# EAGLE board lil_rgb (EAGLE 5.10)
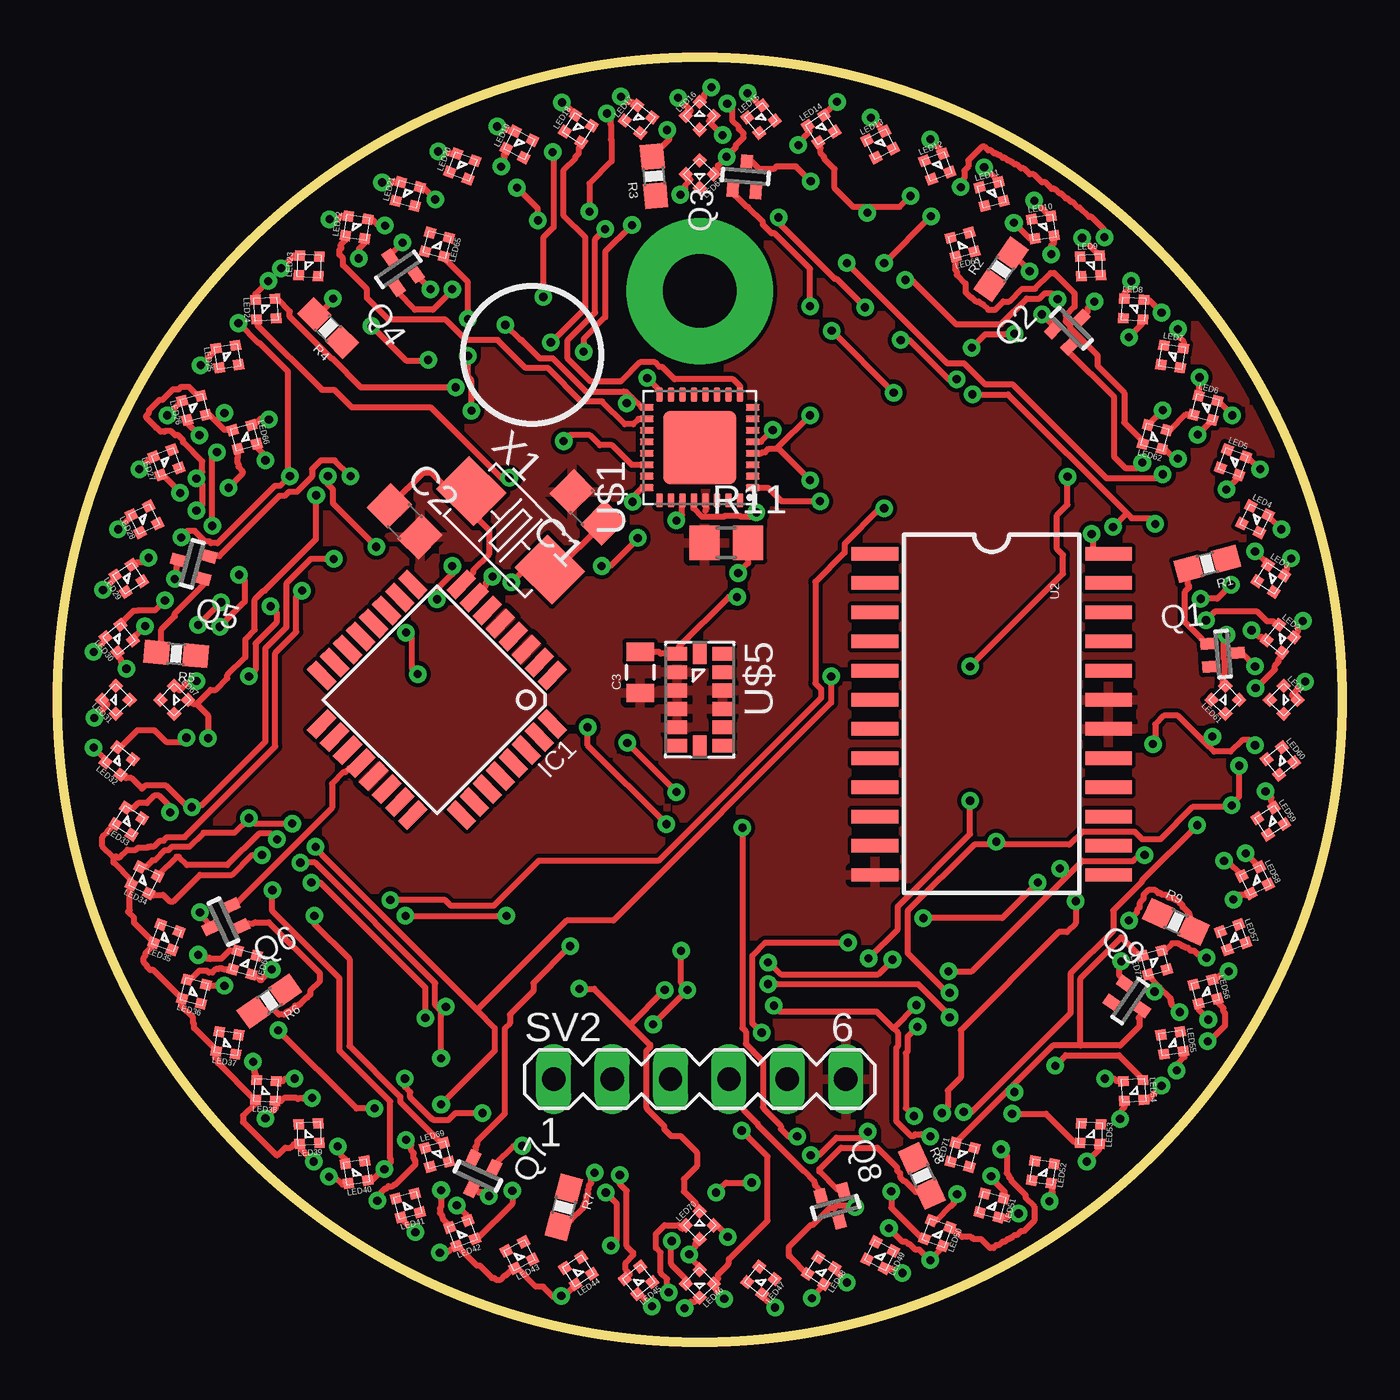
[diagram p3: board, top side]
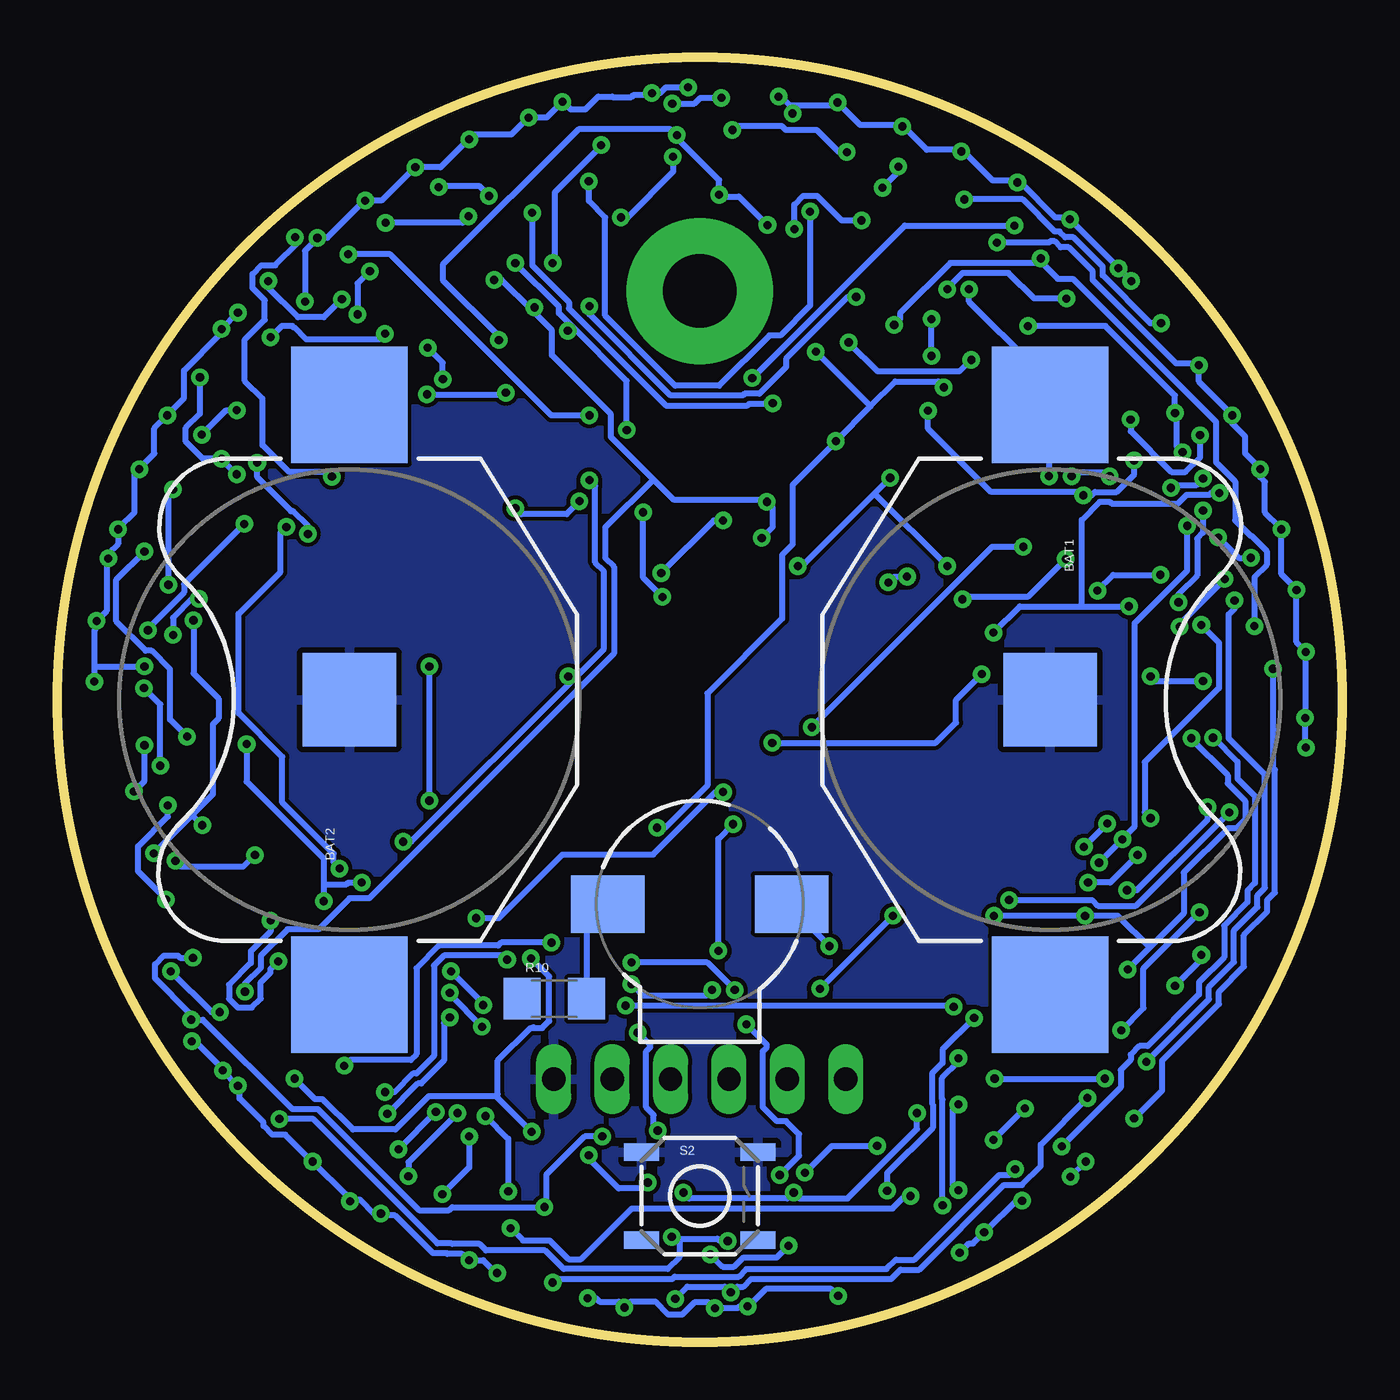
[diagram p4: board, bottom side, seen from below]

Size 55.88 x 55.88 mm. Coordinates in mm from the lower left corner, seen from the top.
Outline: circle at 27.94,27.94 radius 27.94
Copper layers (1*16): Top 0.0356mm / dielectric 1.5011mm / Bottom 0.0356mm
Design rules "SilverCircuits": minimum track width 7mil, minimum drill 14mil, track to track 7mil, track to pad 7mil, pad to pad 7mil, via to via 7mil, smd to smd 0mil, copper to edge 20mil, drill to drill 8mil, minimum pad ring 10mil, minimum via ring 8mil, stop-mask expansion 4mil, vias tented up to drill 0mil, thermal gap 10mil
Net classes: 0 default: width 0.254 mm

## Footprints (pad centres in the part's own frame; a part is rotated, then mirrored left to right if it is on the bottom)
BATTCON_20MM = smd 5.08 x 5.08: 1 -12.827,0; 3 12.827,0 | smd 4.064 x 4.064: 2 0,0
C0805 = smd 1.3 x 1.5: 1 -0.95,0; 2 0.95,0
0805 = smd 0.8 x 1.2: 1 -0.9,0; 2 0.9,0
TQFP32-08 = smd 1.27 x 0.559: 1 -4.293,2.8; 2 -4.293,2; 3 -4.293,1.2; 4 -4.293,0.4; 5 -4.293,-0.4; 6 -4.293,-1.2; 7 -4.293,-2; 8 -4.293,-2.8; 17 4.293,-2.8; 18 4.293,-2; 19 4.293,-1.2; 20 4.293,-0.4; 21 4.293,0.4; 22 4.293,1.2; 23 4.293,2; 24 4.293,2.8 | smd 0.559 x 1.27: 9 -2.8,-4.293; 10 -2,-4.293; 11 -1.2,-4.293; 12 -0.4,-4.293; 13 0.4,-4.293; 14 1.2,-4.293; 15 2,-4.293; 16 2.8,-4.293; 25 2.8,4.293; 26 2,4.293; 27 1.2,4.293; 28 0.4,4.293; 29 -0.4,4.293; 30 -1.2,4.293; 31 -2,4.293; 32 -2.8,4.293
0404_LED = smd 0.45 x 0.45: P$1 0.425,0.425; P$2 0.425,-0.425; P$3 -0.425,-0.425; P$4 -0.425,0.425
SOT416 = smd 0.6 x 0.5: 1 -0.65,0; 2 0.65,-0.5; 3 0.65,0.5
SPARKFUN_0603-RES = smd 1.1 x 1: 1 -0.85,0; 2 0.85,0
1206 = smd 1.6 x 1.8: 1 -1.4,0; 2 1.4,0
R0805 = smd 1.3 x 1.5: 1 -0.95,0; 2 0.95,0
TACTILE_SWITCH_SMD = smd 1.524 x 0.762: 1 -2.54,1.905; 2 2.54,1.905; 3 -2.54,-1.905; 4 2.54,-1.905
BUZZER-CCV = smd 3.2 x 2.5: + 4,0; - -4,0
MA06-1 = drill 1.016 long: 1 -6.35,0; 2 -3.81,0; 3 -1.27,0; 4 1.27,0; 5 3.81,0; 6 6.35,0
SO-24DW = smd 0.584 x 2.032: 1 -6.35,-5.08; 2 -5.08,-5.08; 3 -3.81,-5.08; 4 -2.54,-5.08; 5 -1.27,-5.08; 6 0,-5.08; 7 1.27,-5.08; 8 2.54,-5.08; 9 3.81,-5.08; 10 5.08,-5.08; 11 6.35,-5.08; 12 7.62,-5.08; 13 7.62,5.08; 14 6.35,5.08; 15 5.08,5.08; 16 3.81,5.08; 17 2.54,5.08; 18 1.27,5.08; 19 0,5.08; 20 -1.27,5.08; 21 -2.54,5.08; 22 -3.81,5.08; 23 -5.08,5.08; 24 -6.35,5.08
QFN32 = smd 0.3 x 0.6: 1 -1.75,-2.3; 2 -1.25,-2.3; 3 -0.75,-2.3; 4 -0.25,-2.3; 5 0.25,-2.3; 6 0.75,-2.3; 7 1.25,-2.3; 8 1.75,-2.3; 17 1.75,2.3; 18 1.25,2.3; 19 0.75,2.3; 20 0.25,2.3; 21 -0.25,2.3; 22 -0.75,2.3; 23 -1.25,2.3; 24 -1.75,2.3 | smd 0.6 x 0.3: 9 2.3,-1.75; 10 2.3,-1.25; 11 2.3,-0.75; 12 2.3,-0.25; 13 2.3,0.25; 14 2.3,0.75; 15 2.3,1.25; 16 2.3,1.75; 25 -2.3,1.75; 26 -2.3,1.25; 27 -2.3,0.75; 28 -2.3,0.25; 29 -2.3,-0.25; 30 -2.3,-0.75; 31 -2.3,-1.25; 32 -2.3,-1.75 | smd 3.2 x 3.2: EXP 0,0
LGA-14 = smd 0.6 x 0.9: 1 -2,-1; 2 -1.2,-1; 3 -0.4,-1; 4 0.4,-1; 5 1.2,-1; 6 2,-1; 8 2,1; 9 1.2,1; 10 0.4,1; 11 -0.4,1; 12 -1.2,1; 13 -2,1 | smd 0.9 x 0.6: 7 2,0; 14 -2,0
5032 = smd 2.286 x 2.032: 1 -2.413,0; 2 2.413,0

## Placement (x,y rotation side)
BAT1  [BATTCON_20MM]  12.7,27.94 270 bottom
BAT2  [BATTCON_20MM]  43.18,27.94 90 bottom
C1  [C0805]  23.06,36.31 135 top
C2  [C0805]  15.1,35.7 315 top
C3  [0805]  25.35,29.13 90 top
IC1  MEGA8-AI  [TQFP32-08]  16.51,27.94 225 top
LED1  LX0404SIUPGUSB  [0404_LED]  53.34,27.94 315 top
LED2  LX0404SIUPGUSB  [0404_LED]  53.2,30.59 321 top
LED3  LX0404SIUPGUSB  [0404_LED]  52.78,33.22 327 top
LED4  LX0404SIUPGUSB  [0404_LED]  52.1,35.79 333 top
LED5  LX0404SIUPGUSB  [0404_LED]  51.14,38.27 339 top
LED6  LX0404SIUPGUSB  [0404_LED]  49.94,40.64 345 top
LED7  LX0404SIUPGUSB  [0404_LED]  48.49,42.87 351 top
LED8  LX0404SIUPGUSB  [0404_LED]  46.81,44.94 357 top
LED9  LX0404SIUPGUSB  [0404_LED]  44.94,46.81 3 top
LED10  LX0404SIUPGUSB  [0404_LED]  42.87,48.49 9 top
LED11  LX0404SIUPGUSB  [0404_LED]  40.64,49.94 15 top
LED12  LX0404SIUPGUSB  [0404_LED]  38.27,51.14 21 top
LED13  LX0404SIUPGUSB  [0404_LED]  35.79,52.1 27 top
LED14  LX0404SIUPGUSB  [0404_LED]  33.22,52.78 33 top
LED15  LX0404SIUPGUSB  [0404_LED]  30.59,53.2 39 top
LED16  LX0404SIUPGUSB  [0404_LED]  27.94,53.34 45 top
LED17  LX0404SIUPGUSB  [0404_LED]  25.29,53.2 51 top
LED18  LX0404SIUPGUSB  [0404_LED]  22.66,52.78 57 top
LED19  LX0404SIUPGUSB  [0404_LED]  20.09,52.1 63 top
LED20  LX0404SIUPGUSB  [0404_LED]  17.61,51.14 69 top
LED21  LX0404SIUPGUSB  [0404_LED]  15.24,49.94 75 top
LED22  LX0404SIUPGUSB  [0404_LED]  13.01,48.49 81 top
LED23  LX0404SIUPGUSB  [0404_LED]  10.94,46.81 87 top
LED24  LX0404SIUPGUSB  [0404_LED]  9.07,44.94 93 top
LED25  LX0404SIUPGUSB  [0404_LED]  7.39,42.87 99 top
LED26  LX0404SIUPGUSB  [0404_LED]  5.94,40.64 105 top
LED27  LX0404SIUPGUSB  [0404_LED]  4.74,38.27 111 top
LED28  LX0404SIUPGUSB  [0404_LED]  3.78,35.79 117 top
LED29  LX0404SIUPGUSB  [0404_LED]  3.1,33.22 123 top
LED30  LX0404SIUPGUSB  [0404_LED]  2.68,30.59 129 top
LED31  LX0404SIUPGUSB  [0404_LED]  2.54,27.94 135 top
LED32  LX0404SIUPGUSB  [0404_LED]  2.68,25.29 141 top
LED33  LX0404SIUPGUSB  [0404_LED]  3.1,22.66 147 top
LED34  LX0404SIUPGUSB  [0404_LED]  3.78,20.09 153 top
LED35  LX0404SIUPGUSB  [0404_LED]  4.74,17.61 159 top
LED36  LX0404SIUPGUSB  [0404_LED]  5.94,15.24 165 top
LED37  LX0404SIUPGUSB  [0404_LED]  7.39,13.01 171 top
LED38  LX0404SIUPGUSB  [0404_LED]  9.07,10.94 177 top
LED39  LX0404SIUPGUSB  [0404_LED]  10.94,9.07 183 top
LED40  LX0404SIUPGUSB  [0404_LED]  13.01,7.39 189 top
LED41  LX0404SIUPGUSB  [0404_LED]  15.24,5.94 195 top
LED42  LX0404SIUPGUSB  [0404_LED]  17.61,4.74 201 top
LED43  LX0404SIUPGUSB  [0404_LED]  20.09,3.78 207 top
LED44  LX0404SIUPGUSB  [0404_LED]  22.66,3.1 213 top
LED45  LX0404SIUPGUSB  [0404_LED]  25.29,2.68 219 top
LED46  LX0404SIUPGUSB  [0404_LED]  27.94,2.54 225 top
LED47  LX0404SIUPGUSB  [0404_LED]  30.59,2.68 231 top
LED48  LX0404SIUPGUSB  [0404_LED]  33.22,3.1 237 top
LED49  LX0404SIUPGUSB  [0404_LED]  35.79,3.78 243 top
LED50  LX0404SIUPGUSB  [0404_LED]  38.27,4.74 249 top
LED51  LX0404SIUPGUSB  [0404_LED]  40.64,5.94 255 top
LED52  LX0404SIUPGUSB  [0404_LED]  42.87,7.39 261 top
LED53  LX0404SIUPGUSB  [0404_LED]  44.94,9.07 267 top
LED54  LX0404SIUPGUSB  [0404_LED]  46.81,10.94 273 top
LED55  LX0404SIUPGUSB  [0404_LED]  48.49,13.01 279 top
LED56  LX0404SIUPGUSB  [0404_LED]  49.94,15.24 285 top
LED57  LX0404SIUPGUSB  [0404_LED]  51.14,17.61 291 top
LED58  LX0404SIUPGUSB  [0404_LED]  52.1,20.09 297 top
LED59  LX0404SIUPGUSB  [0404_LED]  52.78,22.66 303 top
LED60  LX0404SIUPGUSB  [0404_LED]  53.2,25.29 309 top
LED61  LX0404SIUPGUSB  [0404_LED]  50.8,27.94 135 top
LED62  LX0404SIUPGUSB  [0404_LED]  47.74,39.37 165 top
LED63  LX0404SIUPGUSB  [0404_LED]  39.37,47.74 195 top
LED64  LX0404SIUPGUSB  [0404_LED]  27.94,50.8 225 top
LED65  LX0404SIUPGUSB  [0404_LED]  16.51,47.74 255 top
LED66  LX0404SIUPGUSB  [0404_LED]  8.14,39.37 285 top
LED67  LX0404SIUPGUSB  [0404_LED]  5.08,27.94 315 top
LED68  LX0404SIUPGUSB  [0404_LED]  8.14,16.51 255 top
LED69  LX0404SIUPGUSB  [0404_LED]  16.51,8.14 15 top
LED70  LX0404SIUPGUSB  [0404_LED]  27.94,5.08 45 top
LED71  LX0404SIUPGUSB  [0404_LED]  39.37,8.14 75 top
LED72  LX0404SIUPGUSB  [0404_LED]  47.74,16.51 105 top
Q1  BC857AT115  [SOT416]  50.71,29.93 185 top
Q2  BC857AT115  [SOT416]  44.1,44.1 225 top
Q3  BC857AT115  [SOT416]  29.93,50.71 265 top
Q4  BC857AT115  [SOT416]  14.83,46.66 305 top
Q5  BC857AT115  [SOT416]  5.86,33.86 345 top
Q6  BC857AT115  [SOT416]  7.22,18.28 25 top
Q7  BC857AT115  [SOT416]  18.28,7.22 65 top
Q8  BC857AT115  [SOT416]  33.86,5.86 105 top
Q9  BC857AT115  [SOT416]  46.66,14.83 145 top
R1  620  [SPARKFUN_0603-RES]  50.02,33.86 195 top
R2  620  [SPARKFUN_0603-RES]  41.05,46.66 55 top
R3  620  [SPARKFUN_0603-RES]  25.95,50.71 95 top
R4  620  [SPARKFUN_0603-RES]  11.78,44.1 135 top
R5  620  [SPARKFUN_0603-RES]  5.17,29.93 175 top
R6  620  [SPARKFUN_0603-RES]  9.22,14.83 215 top
R7  620  [SPARKFUN_0603-RES]  22.02,5.86 255 top
R8  620  [SPARKFUN_0603-RES]  37.6,7.22 295 top
R9  620  [SPARKFUN_0603-RES]  48.66,18.28 335 top
R10  [1206]  34.26,14.94 0 bottom
R11  [R0805]  29.1,34.77 0 top
S2  [TACTILE_SWITCH_SMD]  27.94,6.35 0 bottom
SG1  [BUZZER-CCV]  27.94,19.05 0 bottom
SV2  [MA06-1]  27.94,11.43 0 top
U2  CD74HC154M  [SO-24DW]  40.64,27.94 270 top
U$1  TLC5947  [QFN32]  27.94,38.91 90 top
U$5  MMA7455L  [LGA-14]  27.94,27.94 270 top
X1  [5032]  19.71,35.31 315 top

## Tracks (layer width: path | path; a pad name or v marks a point on that pad's centre or on a via)
COL1  (via drill 0.36)
  Top 0.254: v4.9,23.04 4.9,23.29 4.42,23.77 4.22,23.77 3.89,23.44 3.51,23.44 3.25,23.19 3.18,23.19 3.12,23.24 LED33.P$2 | v14.48,19.23 16.87,19.23 17.12,18.97 18.97,18.97 20.93,20.93 26.14,20.93 33.22,28.02 33.22,28.4 32.97,28.65 32.97,33.07 34.24,34.34 34.24,34.72 35.79,36.27 v35.97,36.27 | v33.17,36.58 31.5,36.58 30.91,37.16 U$1.1
  Bottom 0.254: v4.9,23.04 8.97,18.97 10.62,18.97 10.87,19.23 v14.48,19.23 | v35.97,36.27 35.71,36.02 33.73,36.02 v33.17,36.58
COL4  (via drill 0.36)
  Top 0.254: v7.11,32.18 v6.12,31.19 | v6.05,36.17 6.3,36.42 6.3,37.31 v6.05,37.57 6.12,37.67 6.3,37.85 6.3,38.3 5.46,39.14 5.46,39.24 5.26,39.45 5.13,39.45 4.95,39.62 4.67,39.62 4.65,39.6 4.5,39.6 4.32,39.78 4.29,39.78 3.86,40.21 3.86,40.31 3.99,40.44 3.99,40.54 4.45,41 4.57,41 5.03,41.45 5.28,41.45 5.39,41.55 5.72,41.55 6.1,41.17 6.22,41.17 LED26.P$2 | v7.44,37.16 8.05,37.77 8.05,37.9 7.87,38.08 7.87,38.2 7.82,38.25 7.82,38.46 7.85,38.48 7.85,38.84 LED66.P$2 | LED34.P$2 3.84,20.65 4.14,20.96 4.24,20.96 4.67,21.39 4.83,21.39 4.98,21.54 5.74,21.54 6.35,22.15 7.7,22.15 v8.33,22.78 8.43,22.71 8.59,22.56 v10.21,22.56 | v16.69,6.6 16.69,6.5 16.71,6.48 16.71,6.4 16.74,6.38 16.74,6.3 16.69,6.25 16.69,5.87 16.64,5.82 16.64,5.61 16.74,5.51 16.74,5.44 16.76,5.41 16.76,5.36 17.04,5.08 17.04,5 LED42.P$2 | v16.69,10.34 19.03,12.68 19.03,13.67 18.25,14.44 | 18.25,14.44 11.23,21.46 v11.23,21.54 | v43.23,47.32 43.23,47.7 43.36,47.83 LED10.P$2 | 31.33,38.9 31.29,38.86 30.94,38.86 30.79,38.71 30.66,38.71 30.61,38.66 U$1.4 | 31.33,38.9 v32.74,40.31 | v52.12,28.45 52.3,28.63 52.32,28.63 52.96,29.26 52.96,29.44 53.11,29.59 53.11,29.69 53.26,29.85 53.26,29.97 LED2.P$2 | v51.41,25.07 51.41,23.72 51.08,23.39 v51.08,23.34 50.98,23.27 49.38,23.27 47.98,21.87 47.19,21.87 46.86,22.2 44.58,22.2 44.02,21.64 40.84,21.64 | v51.16,19.25 51.36,19.46 51.66,19.46 51.69,19.43 51.74,19.43 51.82,19.51 51.89,19.51 LED58.P$2 | v36.27,6.55 36.27,5.84 37.62,4.5 LED50.P$2 | v37.26,9.83 36.91,10.19 36.91,12.57 36.98,12.65 36.98,13.28 v37.41,13.72 | v38.81,15.19 38.71,15.19 36.98,16.92 36.98,18.75 39.88,21.64 40.84,21.64
  Top 0.254: v32.74,37.49 31.33,38.9 | v40.84,21.77 40.84,21.64 | v33.66,28.96 33.66,27.81 24.18,18.34 22.15,18.34 18.25,14.44
  Bottom 0.254: v8.33,22.78 8.59,23.04 8.59,25.22 5.36,28.45 5.36,30.43 v6.12,31.19 | v7.11,32.18 7.11,32.54 6.3,33.35 6.3,34.95 6.05,35.2 v6.05,36.17 | v6.05,37.57 6.33,37.29 7.32,37.29 v7.44,37.16 | v16.69,6.6 16.94,6.86 16.94,10.08 v16.69,10.34 | v10.21,22.56 v11.23,21.54 | v43.23,47.32 41.4,47.32 34.39,40.31 v32.74,40.31 | v52.12,28.45 51.41,27.74 v51.41,25.07 | v51.08,23.34 51.08,22.86 52.38,21.57 52.38,20.47 v51.16,19.25 | v36.27,6.55 36.27,8.84 v37.26,9.83 | v37.41,13.72 38.81,15.11 v38.81,15.19 | v32.74,37.49 32.49,37.24 32.49,33.91 32.11,33.53 32.11,30.15 33.48,28.78 | 33.48,28.78 40.49,21.77 v40.84,21.77 | 33.48,28.78 v33.66,28.96
COL5  (via drill 0.36)
  Top 0.254: v41.61,48.69 42.29,48.01 42.49,48.01 LED10.P$3 | v35.97,46.94 v38,48.97 | v31.12,39.67 30.61,39.17 U$1.5 | v51.94,30.96 52.15,30.76 52.2,30.76 52.27,30.68 52.38,30.68 52.5,30.56 52.58,30.56 LED2.P$3 | v47.75,35.59 47.5,35.84 46.74,35.84 46.52,36.06 | 46.52,36.06 41.35,41.22 v39.8,41.22 | v33.68,43.99 v36.37,41.3 | 6.9,40.04 7.26,39.67 7.49,39.67 7.52,39.7 7.6,39.7 LED66.P$3 | 6.9,40.04 6.6,40.34 6.48,40.34 LED26.P$3 | v21.46,43.48 22.96,44.98 22.96,48.06 22.02,49 22.02,50.98 22.53,51.49 22.53,51.56 22.68,51.71 22.68,51.94 22.81,52.07 22.81,52.17 LED18.P$3 | v16.13,42.72 16.1,42.7 15.16,42.7 v13.67,44.2 | 6.9,40.04 v7.26,40.41 | v9.55,21.87 9.3,22.12 8.76,22.12 7.39,20.75 5.64,20.75 5.28,21.11 5.18,21.11 4.37,20.3 LED34.P$3 | v10.57,20.85 11.2,20.85 16.43,15.62 16.43,14.66 16.69,14.4 | v16.69,12.34 16.69,14.4 | v17.37,5.94 17.78,5.54 17.78,5.36 17.83,5.31 LED42.P$3 | v39.14,6.43 38.99,6.27 38.99,6.12 39.01,6.1 39.01,6.05 38.89,5.92 38.86,5.92 38.23,5.28 38.05,5.28 LED50.P$3 | v37.97,8.94 37.95,8.92 37.72,8.92 37.59,9.04 37.31,9.04 37.24,8.97 37.14,8.97 36.47,9.63 36.47,12.78 36.55,12.85 36.55,13.46 36.36,13.65 | 36.36,13.65 35.64,14.38 31.42,14.38 v31.17,14.63 | v16.89,14.58 16.79,14.48 16.69,14.4 | v50.75,20.93 50.88,20.93 51.51,20.3 LED58.P$3 | v47.3,21.18 47.24,21.13 47.02,21.13 46.81,20.93 44.58,20.93 43.93,20.28 | 43.93,20.28 39.78,16.13 v38.76,16.13 | 36.36,13.65 v37.36,14.66 | v6.93,38.71 6.73,38.51 v6.73,35.51 | v45.92,35.46 46.52,36.06 | 43.93,20.28 v43.61,20.6
  Bottom 0.254: v41.61,48.69 38.28,48.69 v38,48.97 | v35.97,46.94 34.06,45.03 34.06,44.76 33.49,44.18 | 33.49,44.18 31.12,41.81 v31.12,39.67 | v51.94,30.96 51.94,31.04 50.37,32.61 50.37,32.97 v47.75,35.59 | v39.8,41.22 39.78,41.2 36.47,41.2 v36.37,41.3 | 33.49,44.18 v33.68,43.99 | v21.46,43.48 20.19,42.22 16.66,42.22 16.15,42.72 v16.13,42.72 | v13.67,44.2 10.29,44.2 7.26,41.17 v7.26,40.41 7.19,40.31 7.19,38.96 v6.93,38.71 | v10.57,20.85 v9.55,21.87 9.47,21.97 9.02,22.43 9.02,31.27 6.73,33.55 v6.73,35.51 | v16.69,12.34 16.69,12.19 17.4,11.48 17.4,10.57 17.37,10.54 v17.37,5.94 | v39.14,6.43 37.97,7.6 v37.97,8.94 | v31.17,14.63 16.94,14.63 v16.89,14.58 | v50.75,20.93 50.5,20.68 47.8,20.68 v47.3,21.18 | v38.76,16.13 37.36,14.73 v37.36,14.66 | v45.92,35.46 46.18,35.2 46.18,33.5 48.01,31.67 48.01,27.36 46.1,25.45 46.1,23.47 43.87,21.23 43.87,20.85 v43.61,20.6
COL6  (via drill 0.36)
  Top 0.254: v51.69,21.26 52.27,20.68 LED58.P$4 | v49.96,31.39 50.34,31.78 52.2,31.78 52.63,31.34 52.91,31.34 53.03,31.22 53.14,31.22 LED2.P$4 | v41.05,8.38 41.3,8.13 41.3,7.34 41.4,7.24 41.4,7.16 41.48,7.09 41.48,7.04 42.11,6.4 42.11,6.27 42.49,5.89 42.49,5.28 42.04,4.83 41.91,4.83 41.73,4.65 41.63,4.65 41.53,4.55 41.48,4.55 41.4,4.47 41.33,4.47 41.22,4.37 41.12,4.37 41,4.24 40.97,4.24 40.95,4.22 40.84,4.22 40.72,4.09 40.56,4.09 40.18,4.47 39.85,4.47 39.75,4.57 39.34,4.57 38.94,4.98 38.84,4.98 LED50.P$4 | v39.42,10.01 39.78,10.01 44.07,14.3 44.07,16.03 45.92,17.88 45.92,18.77 47.19,20.04 47.19,20.09 v49.58,22.48 | v19.79,6.58 19.79,6.02 18.26,4.5 LED42.P$4 | v16,14.1 16,15.42 11.43,19.99 v11.05,19.99 | v8.89,21.18 8.46,21.18 7.6,20.32 6.2,20.32 5.06,19.18 4.88,19.18 4.6,19.46 4.22,19.46 4.19,19.43 4.14,19.43 4.06,19.51 3.99,19.51 LED34.P$4 | v6.17,39.45 5.66,39.95 5.66,40.11 LED26.P$4 | v9.2,40.13 9.12,40.21 9.04,40.21 9.02,40.18 8.87,40.18 8.56,39.88 8.46,39.88 LED66.P$4
  Bottom 0.254: 50.03,22.92 49.12,23.83 49.12,26.87 48.87,27.13 48.87,27.99 49.96,29.08 v49.96,31.39 | 50.03,22.92 v51.69,21.26 | v39.42,10.01 v41.05,8.38 | 50.03,22.92 v49.58,22.48 | v19.79,6.58 19.79,7.34 17.81,9.32 17.81,10.34 17.83,10.36 17.83,11.68 17.37,12.14 17.37,12.73 v16,14.1 | v11.05,19.99 10.08,19.99 v8.89,21.18 | v6.17,39.45 6.17,38.48 6.81,37.85 7.42,37.85 9.2,39.62 v9.2,40.13
COL9  (via drill 0.36)
  Top 0.254: v19.3,51.13 19.46,51.28 19.46,51.56 19.43,51.59 19.43,51.69 19.51,51.77 19.51,51.89 LED19.P$4 | v19.99,50.22 20.9,49.3 v20.9,48.79 | v23.83,48.41 23.39,47.98 23.39,44.78 22.2,43.59 22.2,42.77 23.19,41.78 24.51,41.78 25.35,42.62 25.98,42.62 26.19,42.42 26.31,42.42 26.85,41.89 29.39,41.89 29.69,41.58 29.69,41.22 U$1.9 | v40.62,7.21 40.69,7.14 40.69,7.06 41.2,6.55 41.2,6.48 41.17,6.45 41.17,6.25 LED51.P$4 | v38.48,9.96 38.73,10.21 38.73,10.95 39.29,11.51 39.29,13.56 43.56,17.83 43.92,17.83 44.3,18.21 v44.3,19.18 | v47.65,26.01 47.75,26.11 47.75,26.87 48.13,27.25 48.74,27.25 49.95,26.05 | 49.95,26.05 50.32,25.68 51.03,25.68 51.54,26.19 51.87,26.19 v52.09,25.96 | v52.55,23.95 52.76,23.75 52.76,23.72 52.81,23.67 52.81,23.5 52.93,23.37 52.93,23.27 LED59.P$4 | v6.05,28.75 5.89,28.6 5.59,28.6 5.33,28.35 5.31,28.35 5.11,28.55 LED67.P$4 | v8.33,28.96 8.61,29.24 8.61,30.38 9.53,31.29 9.53,31.75 v9.27,32 | v15.16,30.86 15.42,30.61 15.42,29.31 v15.67,29.06 | v26.92,23.93 v24.79,26.06 | v37.67,18.44 41.1,18.44 v42.65,19.99 | v5.33,36.93 5.33,36.98 4.6,37.72 LED27.P$4 | v52.09,34.39 52.65,33.83 LED3.P$4 | 49.95,26.05 v50.24,26.34
  Bottom 0.254: v19.3,51.13 19.3,50.9 v19.99,50.22 | v20.9,48.79 21.77,48.79 22.84,49.86 23.44,49.86 23.83,49.48 v23.83,48.41 | v40.62,7.21 40.62,7.82 v38.48,9.96 | 44.3,19.91 44.3,21.03 47.65,24.38 v47.65,26.01 | 44.3,19.91 v44.3,19.18 | v52.09,25.96 52.09,24.41 v52.55,23.95 | v6.05,28.75 8.13,28.75 v8.33,28.96 | 11.33,32 14.02,32 v15.16,30.86 | 11.33,32 v9.27,32 | v15.67,29.06 16.79,27.94 16.79,26.95 17.68,26.06 v24.79,26.06 | v26.92,23.93 27.25,23.93 29.97,21.21 33.91,21.21 36.68,18.44 v37.67,18.44 | v42.65,19.99 43.23,19.99 43.31,19.91 44.3,19.91 | v5.33,36.93 5.69,36.93 5.77,36.86 6.76,36.86 7.14,36.47 10.03,36.47 10.11,36.55 10.54,36.55 11.33,35.76 11.33,32 | v52.09,34.39 53.31,33.17 53.31,31.34 52.05,30.07 51.79,30.07 50.98,29.26 50.98,27.08 v50.24,26.34
COL10
  Top 0.254: LED36.P$2 5.66,15.77 5.79,15.77 6.17,16.15 6.5,16.15 6.58,16.08 6.73,16.08 6.88,16.23 7.01,16.23 7.04,16.26 7.16,16.26 7.19,16.23 7.24,16.23 7.26,16.21 7.49,16.21 7.52,16.18 7.6,16.18 LED68.P$2
COL11  (via drill 0.36)
  Top 0.254: v6.12,16.84 6.17,16.79 6.2,16.79 6.22,16.76 6.27,16.76 6.3,16.74 6.38,16.74 6.4,16.71 6.43,16.71 6.45,16.74 6.5,16.69 6.55,16.69 6.58,16.71 6.6,16.71 6.66,16.66 6.68,16.69 7.14,16.69 7.49,17.04 7.82,17.04 LED68.P$3 | v7.26,15.49 7.24,15.52 7.09,15.52 7.06,15.49 6.93,15.49 6.91,15.52 6.48,15.52 LED36.P$3
  Bottom 0.254: v6.12,16.84 6.12,16.64 v7.26,15.49
COL13  (via drill 0.36)
  Top 0.254: v41.53,9.93 43,9.93 44.25,8.69 44.48,8.69 LED53.P$2 | v38.81,14.12 38.81,14.2 37.44,15.57 v30.91,15.57 | v25.91,13.82 v27.41,15.32 27.33,15.42 27.13,15.62 v27.13,17.02 | v24.46,7.26 24.46,6.88 24.77,6.58 24.77,4.17 25.04,3.89 25.04,3.79 24.71,3.45 24.71,3.15 24.89,2.97 24.89,2.95 LED45.P$2 | v3.96,34.11 3.76,33.91 3.45,33.91 3.35,33.81 LED29.P$2 | v5.39,35 5.66,35.28 5.97,35.28 6.43,34.82 6.6,34.82 6.68,34.75 6.96,34.75 9.45,37.24 9.68,37.24 v10.11,37.67 10.03,37.77 10.03,42.22 8.79,43.46 8.74,43.46 v7.87,44.32 | v11.76,37.67 11.74,37.64 11.74,37.34 11.99,37.08 11.99,36.47 v13.87,34.59 | v23.06,26.75 23.06,25.96 v26.49,22.53 | v16.43,49.71 15.93,50.22 15.77,50.22 LED21.P$2 | v50.85,30.76 50.85,30.53 50.72,30.4 50.72,29.74 50.75,29.72 50.75,29.03 50.67,28.96 50.67,28.63 50.78,28.52 50.8,28.52 LED61.P$2 | v49.73,32.33 50.44,32.33 v51.05,32.94 | v50.85,37.08 51.38,37.62 LED5.P$2
  Bottom 0.254: v41.53,9.93 40.21,11.25 40.06,11.25 39.06,12.24 39.06,13.87 v38.81,14.12 | v30.91,15.57 30.4,15.06 27.66,15.06 v27.41,15.32 | v25.91,13.82 25.02,12.93 25.02,12.83 25.2,12.65 25.2,10.21 24.59,9.6 24.18,9.6 23.62,9.04 23.62,8.1 v24.46,7.26 | v3.96,34.11 4.5,34.11 v5.39,35 | v10.11,37.67 10.29,37.85 11.58,37.85 v11.76,37.67 | v13.87,34.59 15.22,34.59 v23.06,26.75 | v26.49,22.53 27.13,21.9 v27.13,17.02 | v16.43,49.71 13.89,49.71 12.5,48.31 12.29,48.31 12.04,48.06 11.68,48.06 10.41,46.79 10.41,46.41 8.33,44.32 v7.87,44.32 | v50.85,30.76 50.85,31.5 50.01,32.33 v49.73,32.33 | v51.05,32.94 51.05,36.88 v50.85,37.08
COL16  (via drill 0.36)
  Top 0.254: v4.67,32.26 4.24,31.83 3.51,31.83 3.48,31.8 3.3,31.8 2.87,31.37 2.87,31.34 2.74,31.22 LED30.P$2 | v8.51,12.19 8.51,12.09 8.56,12.04 8.56,11.79 8.59,11.76 8.59,11.68 8.64,11.63 8.64,11.43 8.66,11.41 LED38.P$2 | v26.72,4.39 26.67,4.34 26.67,3.43 26.72,3.38 26.72,3.35 27.43,2.64 27.36,2.57 27.36,2.54 LED46.P$2 | v29.16,4.57 29.16,4.6 28.6,5.16 28.52,5.08 LED70.P$2 | v46.23,9.7 46.3,9.78 46.3,10.11 46.43,10.24 46.43,10.49 LED54.P$2 | v14.25,48.56 14.17,48.56 14.12,48.62 13.92,48.62 13.72,48.82 13.51,48.82 LED22.P$2 | v25.65,41.94 26.19,41.4 26.19,41.22 U$1.16 | v48.08,40.54 47.45,39.9 LED62.P$2 | v49.61,39.47 50.24,40.11 LED6.P$2
  Bottom 0.254: v4.67,32.26 4.67,31.9 4.93,31.65 4.93,26.26 3.35,24.69 3.35,19.76 3.68,19.43 3.68,18.92 4.7,17.91 4.7,16.54 5.79,15.44 5.79,14.91 v8.51,12.19 | v26.72,4.39 26.75,4.42 27.1,4.42 27.18,4.5 29.08,4.5 v29.16,4.57 28.83,4.39 28.83,3.68 29.34,3.18 33.86,3.18 34.67,3.99 37.24,3.99 37.52,4.27 38.71,4.27 38.73,4.29 39.34,4.29 44.76,9.7 v46.23,9.7 | v14.25,48.56 19.03,48.56 v25.65,41.94 | v48.08,40.54 48.54,40.54 v49.61,39.47
COL17  (via drill 0.36)
  Top 0.254: v3.81,31.14 3.3,30.63 3.3,30.56 LED30.P$3 | v13.11,47.14 13.11,47.55 13.34,47.78 13.34,47.88 13.36,47.9 13.36,47.98 LED22.P$3 | 24.98,41.08 24.74,41.33 24.66,41.33 24.64,41.35 22.99,41.35 21.54,42.8 20.98,42.8 20.19,43.59 20.14,43.59 v19.48,44.25 | 24.98,41.08 25.4,40.67 25.63,40.67 U$1.17 | 27.61,3.81 27.61,3.61 28.02,3.2 27.94,3.12 LED46.P$3 | 27.61,3.81 27.61,4.01 27.76,4.17 27.76,4.32 27.92,4.47 LED70.P$3 | v10.31,11.46 9.91,11.46 9.8,11.35 9.53,11.35 LED38.P$3 | v15.11,11.46 15.11,11.1 15.34,10.87 15.34,10.64 16.28,9.7 16.33,9.7 16.38,9.65 16.99,9.65 17.3,9.96 v18.49,9.96 | v23.85,6.5 24.33,6.02 24.33,4.45 v24.08,4.19 | v27.48,3.81 27.61,3.81 | v45.57,11.46 45.97,11.46 46.08,11.35 46.36,11.35 LED54.P$3 | v35.26,9.14 35,8.89 33.88,8.89 33.12,8.13 v32.77,8.13 | v30.2,6.93 29.08,6.93 v28.65,6.5 | 35.23,49.38 36.63,49.38 v37.11,49.86 | 35.23,49.38 34.62,49.38 33.81,50.19 33.81,51.03 33.35,51.49 33.35,51.56 33.2,51.71 33.2,51.94 33.07,52.07 33.07,52.17 LED14.P$3 | v39.29,50.24 39.29,50.47 39.45,50.62 39.45,50.95 39.62,51.13 39.62,51.41 40.21,51.99 40.34,51.99 40.49,51.84 40.62,51.84 40.74,51.71 40.84,51.71 40.92,51.64 41,51.64 41.12,51.51 41.22,51.51 41.33,51.41 41.4,51.41 41.48,51.33 41.53,51.33 41.63,51.23 41.73,51.23 41.91,51.05 42.04,51.05 42.29,50.8 42.47,50.8 42.82,50.44 42.98,50.44 43.26,50.17 43.36,50.17 43.38,50.14 43.41,50.14 43.59,49.96 43.66,49.96 43.87,49.76 43.94,49.76 44.09,49.61 44.14,49.61 44.4,49.35 44.48,49.35 44.88,48.95 44.98,48.95 45.52,48.41 45.52,48.08 v45.54,48.06 | v43.94,37.64 43.94,36.42 43.48,35.97 43.48,34.49 43.74,34.24 43.74,33.43 v39.7,29.39
  Top 0.254: v39.7,23.55 39.7,22.1 36.55,18.95 36.55,17.96 v35.28,16.69 | v24.77,40.84 24.77,40.87 24.98,41.08 | 35.23,49.38 v35.23,49.12 | LED62.P$3 48.34,39.67 48.36,39.7 48.44,39.7 49.07,40.34 49.4,40.34 LED6.P$3
  Bottom 0.254: v3.81,31.14 3.81,33.27 3.28,33.81 3.28,34.42 3.94,35.08 3.99,35.08 4.65,35.74 4.65,37.44 5.49,38.28 5.49,40.03 11.71,46.25 12.37,46.25 13.11,46.99 v13.11,47.14 13.21,46.94 17.04,46.94 19.23,44.76 19.23,44.5 v19.48,44.25 | v15.11,11.46 v10.31,11.46 | v18.49,9.96 18.49,9.27 21.51,6.25 23.6,6.25 v23.85,6.5 23.95,6.43 24.13,6.25 28.4,6.25 v28.65,6.5 | v24.08,4.19 24.59,3.68 26.04,3.68 26.44,3.28 26.95,3.28 v27.48,3.81 | v45.57,11.46 44.68,10.57 44.35,10.57 43.03,9.25 41.17,9.25 39.73,10.69 36.81,10.69 | v35.26,9.14 36.81,10.69 | v32.77,8.13 32.77,7.98 31.47,6.68 30.46,6.68 v30.2,6.93 | v37.11,49.86 37.54,50.29 39.24,50.29 v39.29,50.24 | v45.54,48.06 45.42,47.93 45.42,47.83 46.41,46.84 47.02,46.84 47.4,46.46 47.4,45.85 46.86,45.31 46.86,44.48 47.73,43.61 47.73,41.81 46.97,41.05 46.97,39.01 45.8,37.85 44.14,37.85 v43.94,37.64 | v39.7,23.55 v39.7,29.39 | v35.28,16.69 34.49,15.9 34.49,13.97 34.8,13.67 35.15,13.67 35.18,13.69 35.2,13.67 35.31,13.67 36.73,12.24 36.73,10.8 36.81,10.69 | v24.77,40.84 25.12,40.84 25.15,40.82 25.78,40.82 25.86,40.74 29.41,40.74 33.63,44.96 33.63,45.24 35.23,46.84 v35.23,49.12
COL18  (via drill 0.36)
  Top 0.254: v49.68,41.96 49.68,41.66 49.66,41.63 49.66,41.17 LED6.P$4 | v48.74,38.43 48.62,38.56 48.46,38.56 48.16,38.86 48.06,38.86 LED62.P$4 | v32.23,52.07 32.39,52.22 32.39,52.32 32.72,52.65 32.72,52.68 32.64,52.76 LED14.P$4 | v34.34,46.94 38.71,42.57 39.45,42.57 40.36,41.66 41.55,41.66 45.64,37.57 47.9,37.57 v48.08,37.74 | v26.59,2.16 26.52,2.24 26.52,2.74 26.24,3.02 26.24,3.89 26.04,4.09 26.04,4.7 26.42,5.08 27.03,5.08 27.18,4.93 27.2,4.93 27.33,5.06 LED70.P$4 | v29.01,1.88 28.65,2.24 28.65,2.34 28.5,2.49 LED46.P$4 28.63,2.64 28.75,2.77 28.73,2.79 28.73,2.92 29.16,3.35 29.16,3.38 29.21,3.43 29.21,3.61 30.89,5.28 30.89,8.08 v29.77,9.2 | v11.07,10.62 10.69,10.62 10.67,10.59 10.49,10.59 10.47,10.57 10.41,10.62 9.86,10.62 9.73,10.49 LED38.P$4 9.5,10.36 9.5,10.19 v9.04,9.73 | v43.41,12.01 43.87,12.47 46.18,12.47 47.19,11.46 47.19,11.41 LED54.P$4 | v34.39,17.37 30.79,17.37 30.23,16.82 30.23,13.87 v30.63,13.46 | v3,29.29 2.82,29.46 2.82,29.54 2.77,29.59 2.77,29.69 2.62,29.85 2.62,29.97 LED30.P$4 | LED22.P$4 12.52,47.93 12.32,47.73 12.32,47.65 12.34,47.62 12.34,47.57 12.27,47.5 12.27,47.3 12.42,47.14 12.42,46.84 13.46,45.8 13.46,45.42 14.4,44.48 16.89,44.48 17.78,43.59 19.15,43.59 20.37,42.37 21.34,42.37 22.78,40.92 23.7,40.92 24.69,39.93 25.04,39.93 25.27,40.16 25.63,40.16 U$1.18
  Bottom 0.254: v49.68,41.96 49.68,40.39 50.29,39.78 50.29,39.17 49.56,38.43 v48.74,38.43 48.67,38.33 v48.08,37.74 | v32.23,52.07 32.23,52.02 34.24,50.01 34.24,47.04 v34.34,46.94 | v29.01,1.88 28.47,2.41 26.85,2.41 v26.59,2.16 26.49,2.24 26.31,2.41 26.04,2.41 25.71,2.74 19.61,2.74 19.2,3.15 18.39,3.15 14.71,6.83 13.92,6.83 13.11,7.65 13.11,8.59 v11.07,10.62 | v43.41,12.01 43.16,12.27 40.51,12.27 40.26,12.52 40.26,16.26 39.27,17.25 36.7,17.25 36.58,17.37 v34.39,17.37 | v30.63,13.46 30.1,12.93 30.1,12.83 30.28,12.65 30.28,10.21 29.95,9.88 29.95,9.37 v29.77,9.2 | v3,29.29 3,24.97 2.92,24.89 2.92,19.56 3.25,19.23 3.25,18.72 4.27,17.7 4.27,16.33 5.36,15.24 5.36,14.71 7.82,12.24 7.82,10.95 v9.04,9.73
COL22  (via drill 0.36)
  Top 0.254: v34.7,5.87 34.67,5.84 34.44,5.84 34.37,5.92 33.88,5.92 33.78,5.82 33.58,5.82 32.84,5.08 32.77,5.08 31.8,4.12 31.8,3.76 31.85,3.71 31.88,3.71 32.61,2.97 LED48.P$2 | v50.06,14.02 49.94,14.15 49.94,14.17 49.63,14.48 49.63,14.71 LED56.P$2 | v49.99,16.71 49.96,16.74 49.89,16.74 49.76,16.87 49.61,16.87 49.45,17.02 49.3,17.02 49.17,17.15 49.07,17.15 49,17.22 48.92,17.22 48.84,17.3 48.79,17.3 48.74,17.35 48.49,17.35 48.16,17.02 48.06,17.02 LED72.P$2 | v17.32,41.53 13.21,41.53 11.94,42.8 11.91,42.8 10.11,44.6 10.11,44.83 9.58,45.36 9.47,45.36 LED24.P$2 | v22.02,39.19 22.28,39.45 23.17,39.45 23.6,39.01 24.13,39.01 24.99,38.15 25.63,38.15 U$1.22 | v28.93,52.5 28.35,53.09 28.35,53.14 28.52,53.31 28.52,53.34 LED16.P$2 | v27.1,49.91 27.31,50.11 27.31,50.32 27.53,50.55 27.53,50.57 27.33,50.78 LED64.P$2 | v46.61,43.71 47.19,44.3 47.19,44.48 LED8.P$2 | v41.63,43.87 41.28,43.87 41.25,43.84 40.36,43.84 v39.78,43.26 | v39.12,41.89 38.76,41.89 37.06,43.59 v36.68,43.59 | v22.89,43.08 22.89,43.64 23.83,44.58 23.83,47.42 v24.99,48.59 | v32.18,8.94 31.8,8.94 31.47,9.27 31.47,9.4 30.73,10.14 30.73,10.16 30.68,10.21 30.68,12.22 30.28,12.62 30.28,12.65 29.95,12.98 29.95,13.51 29.79,13.67 v29.79,22.38 | v12.19,8.51 12.19,8.46 12.34,8.31 12.34,8.26 12.32,8.23 12.32,8.15 12.52,7.95 LED40.P$2 | v5.61,26.29 5.44,26.11 4.72,26.11 4.22,26.62 3.48,26.62 2.74,25.88 2.64,25.88 LED32.P$2
  Bottom 0.254: v49.99,16.71 50.55,16.71 50.65,16.82 51.26,16.82 51.64,16.43 51.64,15.82 50.14,14.33 50.14,14.12 v50.06,14.02 49.56,14.02 45.67,10.14 44.55,10.14 40.16,5.74 38.84,5.74 38.71,5.87 v34.7,5.87 34.62,5.97 34.62,7.26 32.94,8.94 v32.18,8.94 | v17.32,41.53 17.58,41.78 19.43,41.78 20.51,40.7 | 20.51,40.7 v22.02,39.19 22.1,39.09 23.9,37.29 23.9,34.7 24.36,34.24 24.36,31.47 27.61,28.22 27.61,24.21 29.44,22.38 v29.79,22.38 | v46.61,43.71 46.13,44.2 45.67,44.2 45.62,44.14 45.59,44.14 45.06,43.61 41.89,43.61 v41.63,43.87 | v39.78,43.26 39.12,42.6 v39.12,41.89 | v36.68,43.59 36.68,43.76 39.12,46.2 39.12,46.86 33.22,52.76 29.21,52.76 29.03,52.58 v28.93,52.5 28.93,52.38 27.1,50.55 v27.1,49.91 27,49.84 26.24,49.84 v24.99,48.59 | v22.89,43.08 20.51,40.7 | v12.19,8.51 9.63,11.07 9.63,11.84 9.2,12.27 9.2,12.5 8.81,12.88 8.46,12.88 6.22,15.11 6.22,15.65 5.13,16.74 5.13,18.11 4.12,19.13 4.12,19.63 3.79,19.96 3.79,23.75 4.55,24.51 4.55,25.25 5.59,26.29 v5.61,26.29
COL24  (via drill 0.36)
  Top 0.254: v34.34,2.59 33.83,3.1 33.83,3.2 LED48.P$4 | LED40.P$4 13.51,7.06 13.72,7.06 14.17,7.52 v14.22,7.52 14.3,7.62 14.5,7.82 14.5,7.95 14.48,7.98 14.48,10.47 12.27,12.68 12.27,15.82 9.35,18.75 v9.35,19.66 | LED32.P$4 2.74,24.66 2.85,24.66 2.97,24.54 3.23,24.54 3.68,24.08 3.81,24.21 4.72,24.21 5.66,23.27 v5.84,23.27 5.94,23.34 6.27,23.34 9.04,26.11 9.04,30.18 9.96,31.09 9.96,33 11.02,34.06 v12.01,34.06 | v27,54.13 27.56,53.57 27.36,53.37 27.36,53.34 LED16.P$4 | v29.13,53.87 29.36,53.64 29.36,53.14 29.64,52.86 29.64,52.78 29.85,52.58 29.85,52.4 29.52,52.07 29.52,51.97 v29.11,51.56 28.73,51.18 28.73,51 28.52,50.8 LED64.P$4 | 47.94,15.43 48.41,14.96 48.41,14.91 48.44,14.88 48.44,14.78 48.46,14.76 48.46,14.68 48.77,14.38 48.79,14.38 v48.82,14.35 | 47.94,15.43 47.45,15.93 47.45,15.98 LED72.P$4 | v50.95,16.13 50.9,16.08 50.85,16.08 50.75,15.98 50.65,15.98 50.62,15.95 50.57,15.95 50.34,15.72 50.27,15.72 50.24,15.75 LED56.P$4 | v25.02,36.55 25.15,36.68 25.15,36.86 25.45,37.16 25.63,37.16 U$1.24 | v25.25,34.98 25.25,34.95 24.05,33.76 v23.67,33.76 | v19.66,37.59 19.53,37.47 19.43,37.47 16.23,40.67 12.8,40.67 12.04,41.43 11.51,41.43 8.69,44.25 8.69,44.48 LED24.P$4 | v46.71,46.15 46.69,46.13 46.69,45.9 46.43,45.64 46.43,45.39 LED8.P$4 | v43.51,45.36 43.26,45.62 42.95,45.62 42.72,45.39 42.16,45.39 41.05,44.27 39.09,44.27 37.16,46.2 v36.88,46.2 | v47.73,15.24 47.75,15.24 47.94,15.43 | v31.37,48.92 31.37,48.69 33.81,46.25 33.88,46.25 v35.13,45.01 | v16.51,32.31 16.64,32.44 16.64,32.54 16.61,32.56 16.61,32.84 17.17,33.4 v17.17,33.76
  Bottom 0.254: v14.22,7.52 14.48,7.26 14.91,7.26 18.59,3.58 19.41,3.58 19.81,3.18 25.91,3.18 26.24,2.85 29.03,2.85 29.13,2.74 34.19,2.74 v34.34,2.59 | v5.84,23.27 5.84,22.73 8.92,19.66 v9.35,19.66 | v27,54.13 27.92,54.13 28.17,53.87 v29.13,53.87 | v48.82,14.35 49.17,14.35 v50.95,16.13 | v25.25,34.98 24.77,35.46 24.77,36.3 v25.02,36.55 25.12,36.63 29.06,36.63 29.96,37.53 | v23.67,33.76 23.5,33.76 20.33,36.92 | v19.66,37.59 20.33,36.92 | v46.71,46.15 46.71,45.87 45.42,44.58 44.3,44.58 v43.51,45.36 | v36.88,46.2 36.55,46.2 35.24,44.89 | 35.24,44.89 34.37,44.02 34.37,42.93 31.8,40.36 31.8,39.37 29.96,37.53 | v47.73,15.24 47.73,15.6 47.04,16.28 47.04,16.79 45.87,17.96 44.53,17.96 43.18,19.3 42.32,19.3 31.67,29.95 31.67,33.73 32.06,34.11 32.06,35.43 29.96,37.53 | v29.11,51.56 29.08,51.56 29.08,50.93 31.09,48.92 v31.37,48.92 | v35.13,45.01 35.24,44.89 | v12.01,34.06 13.64,32.44 16.38,32.44 v16.51,32.31 | 20.33,36.92 v17.17,33.76
GND
  Top 0.254: U$1.29 28.19,36.37 28.22,36.35 28.19,36.15
  pour Bottom: -5.76,57.94 60.44,57.94 60.44,-4.96 -5.76,-4.96
  pour Top: -4.96,57.24 59.34,57.24 59.34,-3.96 -4.96,-3.96
LINE1  (via drill 0.36)
  Top 0.254: v48.74,44.07 48.74,43.76 49,43.51 49,43.23 LED7.P$1 | v48.03,44.78 47.5,45.31 47.27,45.31 LED8.P$1 | v53.67,34.09 53.47,33.88 53.47,33.58 53.37,33.48 LED3.P$1 | v53.24,35.36 52.68,35.92 LED4.P$1 | v52.32,37.97 51.79,38.51 51.71,38.51 LED5.P$1 | v54.18,31.37 53.95,31.14 53.95,30.89 53.82,30.76 53.82,30.66 LED2.P$1 | v54.28,28.73 53.7,28.14 53.9,27.94 LED1.P$1 | v51.11,40.31 50.6,40.82 50.57,40.82 50.47,40.92 LED6.P$1 | v52.09,29.39 51.51,29.97 51.38,29.97 Q1.1
  Bottom 0.254: v48.03,44.78 v48.74,44.07 48.82,43.97 48.82,43.81 50.37,42.27 50.37,41.07 51.03,40.41 v51.11,40.31 51.66,39.75 51.66,38.66 52.25,38.08 v52.32,37.97 52.53,37.77 52.53,36.09 53.16,35.46 v53.24,35.36 53.24,34.72 53.67,34.29 v53.67,34.09 53.75,33.98 53.75,31.8 v54.18,31.37 54.23,31.27 54.23,31.01 54.28,30.96 54.28,29.39 | 54.28,29.39 v54.28,28.73 | 54.28,29.39 v52.09,29.39
LINE2  (via drill 0.36)
  Top 0.254: v28.45,54.59 28.12,54.25 28.12,54.1 27.97,53.95 LED16.P$1 | v30.02,54.33 30.53,53.82 30.63,53.82 LED15.P$1 | v35.38,53.26 LED13.P$1 | v33.91,53.95 33.35,53.39 LED14.P$1 | v37.97,52.32 38.51,51.79 38.51,51.71 LED12.P$1 | v40.31,51.11 40.82,50.6 40.82,50.57 40.92,50.47 LED11.P$1 | v42.49,49.66 43.16,49 43.2,49 LED10.P$1 | v44.58,48.03 45.21,47.4 45.21,47.37 45.31,47.27 LED9.P$1 | v45.11,45.26 44.81,44.96 44.81,44.81 Q2.1
  Bottom 0.254: v28.45,54.59 29.41,54.59 29.67,54.33 v30.02,54.33 30.12,54.25 30.81,54.25 30.91,54.15 31.73,54.15 31.75,54.18 32.36,54.18 32.92,53.62 33.55,53.62 33.81,53.87 v33.91,53.95 34.59,53.26 v35.38,53.26 35.48,53.19 36.14,52.53 37.77,52.53 v37.97,52.32 38.08,52.25 39.22,51.11 v40.31,51.11 40.41,51.03 41.78,49.66 v42.49,49.66 42.6,49.58 44.14,48.03 v44.58,48.03 44.65,47.93 45.11,47.47 v45.11,45.26
LINE4  (via drill 0.36)
  Top 0.254: v9.17,46.15 8.61,45.59 LED24.P$1 | v9.73,46.71 10.29,47.27 LED23.P$1 | v11.84,48.84 12.22,48.84 12.37,49 12.65,49 LED22.P$1 | v14.12,50.44 14.15,50.42 14.55,50.42 14.63,50.5 14.71,50.5 14.73,50.47 LED21.P$1 | v16.56,51.79 16.64,51.71 17.35,51.71 LED20.P$1 | v19.13,52.88 19.28,52.73 19.69,52.73 19.74,52.68 19.89,52.68 LED19.P$1 | v21.95,53.92 22,53.92 22.53,53.39 LED18.P$1 | v24.51,54.18 24.74,53.95 24.99,53.95 25.12,53.82 25.22,53.82 LED17.P$1 | v32.77,50.5 32.13,51.13 31.27,51.13 31.17,51.03 30.53,51.03 30.2,51.36 Q3.1 | v23.14,49.17 23.14,50.39 24.11,51.36 24.11,52.3 24.08,52.32 24.08,52.96 24.05,52.98 24.05,53.29 v23.9,53.44
  Bottom 0.254: v9.17,46.15 v9.73,46.71 9.8,46.81 v11.84,48.84 11.94,48.92 12.47,48.92 14,50.44 v14.12,50.44 14.22,50.52 15.19,50.52 16.46,51.79 v16.56,51.79 16.66,51.87 18.06,51.87 19.08,52.88 v19.13,52.88 19.23,52.93 20.96,52.93 v21.95,53.92 22.05,53.85 22.12,53.77 23.9,53.77 | v24.51,54.18 24.41,54.18 24,53.77 23.9,53.77 | v32.77,50.5 32.77,49.63 32.06,48.92 32.06,44.65 29.01,41.61 27.1,41.61 24.92,43.79 24.44,43.79 23.14,45.09 v23.14,49.17 | 23.9,53.77 v23.9,53.44
LINE6  (via drill 0.36)
  Top 0.254: v1.6,27.15 2.18,27.74 1.98,27.94 LED31.P$1 | v1.58,25.86 2.08,25.35 2.08,25.25 LED32.P$1 | v1.58,30.02 2.08,30.53 2.08,30.63 LED30.P$1 | v1.98,32.72 2.49,33.22 2.49,33.33 LED29.P$1 | v2.64,35.36 3.2,35.92 LED28.P$1 | v3.56,37.97 4.09,38.51 4.17,38.51 LED27.P$1 | v4.78,40.31 5.28,40.82 5.31,40.82 5.41,40.92 LED26.P$1 | v6.22,42.49 6.88,43.16 6.88,43.2 LED25.P$1 | v15.01,47.83 14.48,47.3 14.48,47.22 Q4.1
  Bottom 0.254: v1.58,25.86 1.6,25.88 v1.6,27.15 1.58,27.25 v1.58,30.02 1.65,30.12 1.98,30.46 v1.98,32.72 2.06,32.82 2.64,33.4 v2.64,35.36 2.72,35.46 3.35,36.09 3.35,37.41 3.56,37.62 v3.56,37.97 3.63,38.08 4.22,38.66 4.22,39.39 4.78,39.95 v4.78,40.31 4.85,40.41 6.22,41.78 v6.22,42.49 6.33,42.57 7.21,42.57 10.85,46.2 10.85,46.58 11.89,47.62 12.24,47.62 12.5,47.88 12.7,47.88 12.75,47.83 v15.01,47.83
LINE8  (via drill 0.36)
  Top 0.254: v11.15,7.85 10.57,8.43 10.57,8.61 LED39.P$1 10.41,8.61 10.29,8.61 10.14,8.46 9.91,8.46 9.58,8.13 9.53,8.13 8.08,9.58 8.08,9.86 8.61,10.39 8.61,10.41 LED38.P$1 8.61,10.57 8.56,10.57 6.99,12.14 6.99,12.27 6.86,12.4 6.86,12.62 6.88,12.65 LED37.P$1 6.86,12.75 5.94,13.67 5.94,13.84 5.89,13.89 5.89,14.12 5.39,14.63 5.39,14.71 5.41,14.73 LED36.P$1 5.33,15.01 4.17,16.18 4.04,16.18 3.89,16.33 3.89,16.38 3.76,16.51 3.76,16.74 3.84,16.82 3.84,16.92 4.17,17.25 4.17,17.35 LED35.P$1 4.12,17.45 3.33,18.24 3.33,18.47 3.07,18.72 3.15,18.8 3.15,19.69 3.2,19.74 3.2,19.89 LED34.P$1 3.23,20.04 3.23,20.07 2.44,20.85 2.44,21.08 | v11.81,7.19 12.07,7.19 12.4,6.86 12.62,6.86 12.65,6.88 LED40.P$1 | 2.44,21.08 1.96,21.57 1.96,21.97 2.18,22.2 2.18,22.23 2.49,22.53 LED33.P$1 | v5.11,33.2 5.11,33.35 5.18,33.43 5.18,33.71 5.21,33.73 5.21,34.01 Q5.1 | v7.06,31.12 8.15,32.21 8.15,33.12 v7.9,33.38 | v10.64,32.69 10.39,32.44 10.39,30.89 9.47,29.97 9.47,25.91 5.54,21.97 4.78,21.97 4.62,21.82 4.47,21.82 4.22,21.57 4.06,21.57 4.04,21.54 3.94,21.54 3.91,21.51 3.51,21.51 3.4,21.41 3.05,21.41 2.72,21.08 2.59,21.08 2.54,21.13 2.44,21.08
  Bottom 0.254: v11.81,7.19 v11.15,7.85 | v5.11,33.2 7.06,31.24 v7.06,31.12 | v7.9,33.38 9.96,33.38 v10.64,32.69
LINE11  (via drill 0.36)
  Top 0.254: v31.22,1.5 31.19,1.5 30.96,1.73 30.94,1.73 30.66,2.01 30.66,2.06 LED47.P$1 | v32.82,1.91 32.82,1.93 33.33,2.44 33.33,2.49 LED48.P$1 | v27.28,1.47 27.56,1.75 27.74,1.75 27.92,1.93 LED46.P$1 | v25.86,1.55 25.35,2.06 25.25,2.06 LED45.P$1 | 21.92,1.96 22,1.96 22.53,2.49 LED44.P$1 | 21.92,1.96 21.59,1.96 21.13,2.41 20.8,2.41 20.02,3.2 LED43.P$1 19.79,3.18 19.51,2.9 19.46,2.9 19.28,2.72 19.08,2.72 19,2.79 18.9,2.79 18.36,3.33 18.24,3.33 17.45,4.12 LED42.P$1 17.35,4.17 17.25,4.17 17.04,3.96 17.02,3.96 16.87,3.81 16.71,3.81 v16.64,3.89 | v21.92,2.01 21.92,1.96 | v15.57,4.78 15.06,5.28 15.06,5.31 14.96,5.41 LED41.P$1 | v6.2,18.69 6.3,18.59 6.3,18.57 6.33,18.54 6.33,18.49 6.35,18.47 6.35,18.44 6.63,18.16 Q6.1 | v9.6,13.56 13.01,10.16 v13.79,10.16 | v15.16,8.79 15.39,8.56 15.39,8.33 15.49,8.23 15.49,7.98 15.57,7.9 15.57,7.72 14.71,6.86 14.66,6.86 14.58,6.78 14.4,6.78 14.3,6.68 14.25,6.68 14.07,6.5 14.07,6.33 13.92,6.17 v13.92,6.15
  Bottom 0.254: v32.82,1.91 32.46,1.91 32.31,1.75 31.47,1.75 v31.22,1.5 31.12,1.58 30.94,1.75 29.87,1.75 29.31,1.19 28.7,1.19 28.17,1.73 27.56,1.73 27.38,1.55 v27.28,1.47 26.29,1.47 26.21,1.55 v25.86,1.55 25.76,1.63 25.07,2.31 22.23,2.31 v21.92,2.01 | v16.64,3.89 16.23,4.29 16.05,4.29 v15.57,4.78 15.47,4.85 14.17,6.15 v13.92,6.15 | v6.2,18.69 8.64,16.26 8.64,14.53 v9.6,13.56 | v15.16,8.79 v13.79,10.16
LINE13  (via drill 0.36)
  Top 0.254: v48.03,11.15 47.45,10.57 47.27,10.57 LED54.P$1 | v48.69,11.81 48.69,12.07 49.02,12.4 49.02,12.62 49,12.65 LED55.P$1 | v50.04,13.08 50.11,13.08 50.8,13.77 50.8,14.3 50.72,14.38 50.72,14.53 50.47,14.78 LED56.P$1 | v41.81,5.59 41.45,5.59 41.25,5.39 41.17,5.39 41.15,5.41 LED51.P$1 | v43.16,6.12 43.26,6.22 43.26,6.3 43.28,6.33 43.28,6.53 43.26,6.55 43.26,6.86 43.23,6.88 LED52.P$1 | v44.78,7.85 45.31,8.38 45.31,8.61 LED53.P$1 | v36.75,3 36.6,3.15 36.2,3.15 36.14,3.2 35.99,3.2 LED49.P$1 | LED50.P$1 38.51,4.17 38.51,4.09 v37.97,3.56 37.87,3.63 37.49,4.01 37.31,4.01 37.06,4.27 37.01,4.27 36.91,4.37 36.75,4.37 v36.17,4.95 | v18.77,6.35 18.72,6.4 18.64,6.4 18.54,6.5 18.34,6.5 18.21,6.63 Q7.1
  Bottom 0.254: v50.04,13.08 49.89,13.08 48.72,11.91 v48.69,11.81 v48.03,11.15 47.95,11.05 47.95,10.59 46.91,9.55 46.91,9.4 46.53,9.02 45.97,9.02 44.88,7.93 v44.78,7.85 43.28,6.35 43.26,6.35 43.18,6.27 v43.16,6.12 43.08,6.2 42.72,6.2 42.11,5.59 v41.81,5.59 41.71,5.51 41.2,5.51 39.55,3.86 38.94,3.86 38.91,3.84 38.28,3.84 38.08,3.63 v37.97,3.56 37.36,3.56 36.81,3 v36.75,3 | v18.77,6.35 19.03,6.35 19.56,5.82 30.89,5.82 33.1,3.61 33.66,3.61 34.47,4.42 35.64,4.42 v36.17,4.95
LINE15
  Top 0.254: LED62.P$1 47.19,39.09 47.19,39.22 46.41,40.01 46.41,41.3 45.24,42.47 45.24,42.93 44.04,44.12 44.04,44.22 43.87,44.4 43.87,44.65 44.25,45.03 44.25,45.62 43.36,46.51 43.2,46.51 42.52,45.82 41.96,45.82 41.4,45.26 41.15,45.26 40.79,44.91 40.49,44.91 40.26,45.14 40.23,45.14 40.18,45.19 40.16,45.19 40.08,45.26 39.95,45.26 39.78,45.44 39.73,45.44 39.5,45.67 39.5,46.05 39.12,46.43 39.12,46.58 39.04,46.66 39.04,46.84 39.06,46.86 39.06,47.19 LED63.P$1
LINE17  (via drill 0.36)
  Top 0.254: 41.44,11.04 43.31,12.9 44.5,12.9 | 41.44,11.04 39.09,8.69 LED71.P$1 | 44.5,12.9 46.23,12.9 47.07,13.74 47.07,14.07 47.04,14.1 47.04,14.12 47.22,14.3 47.22,14.45 Q9.1 | LED72.P$1 47.19,16.82 47.07,16.82 46.28,17.6 44.5,15.82 44.5,12.9 | v9.04,38.35 8.97,38.43 8.97,38.63 8.69,38.91 8.69,39.06 LED66.P$1 | v11.25,36.83 11.25,34.92 9.02,32.69 8.97,32.69 8.59,32.31 8.59,30.99 8.18,30.58 8.18,29.79 7.39,29.01 7.39,28.88 6.88,28.37 6.66,28.37 6.05,27.76 | 6.05,27.76 5.89,27.76 5.69,27.97 5.66,27.94 LED67.P$1 | v9.32,16.21 8.87,15.75 8.81,15.75 8.56,16 8.46,16 LED68.P$1 | v6.55,26.26 6.55,27.25 6.05,27.76 | v11.18,18.54 11.18,18.19 12.7,16.66 12.7,12.88 14.91,10.67 14.91,10.44 16.66,8.69 16.79,8.69 LED69.P$1 | 24.91,13.81 23.34,15.37 v22.71,15.37 | 24.91,13.81 25.78,12.93 25.78,12.83 25.6,12.65 25.6,10.21 25.65,10.16 25.65,10.14 26.39,9.4 26.39,9.27 26.7,8.97 27.1,8.97 27.81,8.26 27.81,7.65 27.25,7.09 27.25,6.55 27.76,6.05 27.76,5.99 28.02,5.74 27.97,5.69 LED70.P$1 | v15.14,18.54 v19.53,18.54 | v17.86,44.5 17.86,46.1 16.82,47.14 16.82,47.19 LED65.P$1 | v17.86,42.9 17.86,41.99 18.01,41.83 v18.01,40.51 | v41.63,10.87 41.61,10.87 41.44,11.04 | v36.32,16.64 36.32,16.61 35.71,16 31.47,16 30.96,16.51 v30.91,16.51 | 24.91,13.81 v26.42,15.32
  Bottom 0.254: v9.04,38.35 9.04,37.74 9.8,36.98 10.74,36.98 10.9,36.83 v11.25,36.83 11.35,36.91 11.43,36.98 15.27,36.98 18.01,39.73 v18.01,40.51 | 8.37,17.16 6.88,18.64 6.88,20.42 4.95,22.35 4.6,22.35 4.22,22.73 4.22,23.55 4.98,24.31 4.98,24.66 6.55,26.24 v6.55,26.26 | 8.37,17.16 v9.32,16.21 | 8.37,17.16 9.75,18.54 v11.18,18.54 v15.14,18.54 | v19.53,18.54 v22.71,15.37 | v17.86,42.9 v17.86,44.5 | v41.63,10.87 41.22,10.87 40.41,11.68 40.26,11.68 39.5,12.45 39.5,16.38 39.06,16.82 36.5,16.82 v36.32,16.64 | v30.91,16.51 27.61,16.51 v26.42,15.32
N$1  (via drill 0.36)
  Top 0.254: v42.82,44.7 43.41,44.12 43.31,44.02 Q2.2 | v42.29,46.58 41.53,47.35 R2.2
  Bottom 0.254: v42.82,44.7 42.82,46.05 v42.29,46.58
N$2
  Top 0.254: R1.2 49.17,33.63 49.17,32.94 49.23,32.89 49.23,32.82 49.05,32.64 49.05,31.32 50.01,30.35 Q1.2
N$3
  Top 0.254: Q5.2 6.35,32.94 5.11,31.7 5.11,31.57 4.52,30.99 4.52,30.2 4.34,30.02 R5.2
N$4  (via drill 0.36)
  Top 0.254: v46.28,16.56 46.18,16.46 46.18,15.95 46.41,15.72 46.41,15.62 Q9.2 | v46.61,18.34 46.97,18.69 46.97,18.8 47.07,18.9 47.07,19.08 47.12,19.13 47.12,19.15 47.24,19.28 47.24,19.46 47.45,19.66 47.75,19.66 47.88,19.53 47.98,19.53 48.06,19.46 48.21,19.46 48.34,19.33 48.46,19.33 48.51,19.28 48.59,19.28 48.64,19.23 48.69,19.23 48.82,19.1 48.84,19.1 48.95,19 48.95,18.92 49.25,18.62 49.25,18.54 49.28,18.52 49.28,18.09 49.43,17.93 R9.2
  Bottom 0.254: v46.28,16.56 46.61,16.23 46.61,16.08 47.04,15.65 47.04,14.94 47.42,14.55 48.03,14.55 48.41,14.94 48.41,15.55 47.47,16.49 47.47,16.99 46.61,17.86 v46.61,18.34
N$5
  Bottom 0.254: R10.2 32.87,18.82 32.64,19.05 SG1.-
N$6  (via drill 3.2 pad 6.35)
  other vias: 27.94,45.72
N$7  (via drill 0.36)
  Top 0.254: v18.92,33.3 18.64,33.02 18.64,32.92 18.14,32.41 IC1.7 | v19.74,33.05 19.76,33.05 20.73,34.01 20.93,34.01 20.96,34.04 21.41,33.58 X1.2 21.51,33.53 21.57,33.48 21.59,33.48 23.72,35.61 C1.1
  Bottom 0.254: v18.92,33.3 19.48,33.3 v19.74,33.05
N$8
  Top 0.254: IC1.8 18.09,33.48 18.09,33.58 18.77,34.27 18.77,35.33 18.26,35.84 18.26,36.32 18.49,36.55 18.01,37.03 X1.1 17.91,37.08 17.5,37.49 17.27,37.26 16.82,37.26 16.28,37.8 15.9,37.8 15.24,37.14 15.22,37.14 14.45,36.37 C2.1
N$13  (via drill 0.36)
  Top 0.254: v26.92,35.74 27.18,35.99 27.18,36.6 U$1.27 | v29.62,33.45 30.05,33.88 30.05,34.75 R11.2
  Bottom 0.254: v26.92,35.74 27.33,35.74 v29.62,33.45
N$52
  Top 0.254: R6.2 8.53,14.35 8.99,14.35 9.25,14.61 9.27,14.61 9.63,14.25 9.86,14.25 9.98,14.38 10.08,14.38 10.34,14.63 10.47,14.63 10.54,14.71 10.57,14.71 10.85,14.99 10.87,14.99 11,15.11 11,15.29 11.41,15.7 11.41,16.05 9.2,18.26 8.61,18.26 8.59,18.24 8.56,18.24 8.53,18.21 8.31,18.21 8.2,18.11 Q6.2
N$53  (via drill 0.36)
  Top 0.254: v20.22,8.53 19.84,8.53 19.03,7.72 19.03,7.62 Q7.2 | v23.37,7.37 23.22,7.21 23.22,6.91 23.11,6.81 23.11,6.68 23.09,6.66 23.09,6.45 23.01,6.38 23.01,6.12 22.94,6.05 22.94,5.94 22.86,5.87 22.86,5.82 22.35,5.31 22.07,5.31 21.82,5.06 R7.2
  Bottom 0.254: v20.22,8.53 22.2,8.53 v23.37,7.37
N$54
  Top 0.254: R8.2 37.95,6.45 37.59,6.45 37.52,6.53 37.34,6.53 36.86,7.01 36.81,7.01 36.68,7.14 36.68,7.16 36.65,7.19 36.65,7.34 36.53,7.47 36.53,7.6 35.66,8.46 34.09,8.46 33.15,7.52 33.15,7.42 33.93,6.63 Q8.2
N$69  (via drill 0.36)
  Top 0.254: v32.74,45.06 32.74,46.69 31.19,48.23 31.06,48.23 30.68,48.62 30.68,48.74 30.05,49.38 30,49.38 29.39,49.99 29.39,50.09 Q3.2 | v21.13,45.47 21.13,48.03 21.59,48.49 21.59,51.71 v21.54,51.77 | v26.52,52.73 26.65,52.6 26.65,52.43 26.62,52.4 26.62,52.32 25.86,51.56 R3.2
  Bottom 0.254: v32.74,45.06 32.74,44.7 29.21,41.17 26.06,41.17 25.98,41.25 25.35,41.25 24.18,42.42 24.18,42.77 21.49,45.47 v21.13,45.47 | v21.54,51.77 21.9,51.77 22.86,52.73 24.21,52.73 24.38,52.91 26.34,52.91 v26.52,52.73
N$94  (via drill 0.36)
  Top 0.254: v17.17,45.8 17.17,45.75 16.33,44.91 15.55,44.91 14.81,45.64 14.81,45.82 Q4.2 | v11.99,45.39 11.99,45.36 12.01,45.34 11.3,44.63 11.28,44.63 11.18,44.73 R4.2
  Bottom 0.254: v17.17,45.8 17.17,45.85 16.51,46.51 14.5,46.51 13.39,45.39 v11.99,45.39
VCC  (via drill 0.36)
  Top 0.254: C3.2 26.16,30.02 26.24,29.95 26.92,29.95 U$5.1 27.03,30.02 27.03,30.23 29.21,32.41 v29.57,32.41 | v30.4,36.09 30.2,35.89 29.74,35.89 29.69,35.94 29.03,35.94 28.98,35.89 28.04,35.89 27.66,36.27 27.66,36.35 27.69,36.37 U$1.28 | Q6.3 7.62,19.03 7.72,19.03 11.94,23.24 11.94,24.28 12.45,24.79 12.52,24.79 12.7,24.97 12.73,24.97 12.85,24.84 13.18,25.17 IC1.20 | v12.75,37.67 12.07,38.35 11.46,38.35 11.07,37.97 11.07,37.64 10.41,36.98 10.06,36.98 9.88,36.81 9.65,36.81 7.04,34.19 6.63,34.19 Q5.3 | v16.23,45.8 15.62,46.41 Q4.3 | v47.19,38.25 46.94,38 46.48,38 45.97,38.51 45.97,41.1 43.89,43.18 Q2.3 | v44.98,35.15 45.06,35.08 45.06,34.31 45.09,34.29 U2.24 | v22.3,17.22 20.7,15.62 20.7,15.27 19.69,14.25 19.69,13.87 19.46,13.64 19.46,9.93 18.26,8.74 18.26,8.61 18.24,8.59 18.24,8.56 18.21,8.53 18.21,8.51 18.19,8.48 18.19,8.33 18.11,8.26 Q7.3 | SV2.4 29.21,10.74 30.46,9.5 30.46,9.45 32.46,7.44 32.49,7.44 32.92,7.01 32.92,6.96 32.94,6.93 32.94,6.86 32.97,6.83 32.97,6.81 33.2,6.58 33.2,6.38 Q8.3
  Bottom 0.254: v30.4,36.09 30.4,33.25 v29.57,32.41 | v12.75,37.67 12.75,40.77 BAT1.1 13.41,40.77 13.44,40.79 13.44,42.47 16.23,45.26 v16.23,45.8 | v47.19,38.25 47.19,37.62 45.72,36.14 45.62,36.14 44.98,35.51 v44.98,35.15 | v22.3,17.22 23.22,18.14 23.22,19.03 23.24,19.05 SG1.+